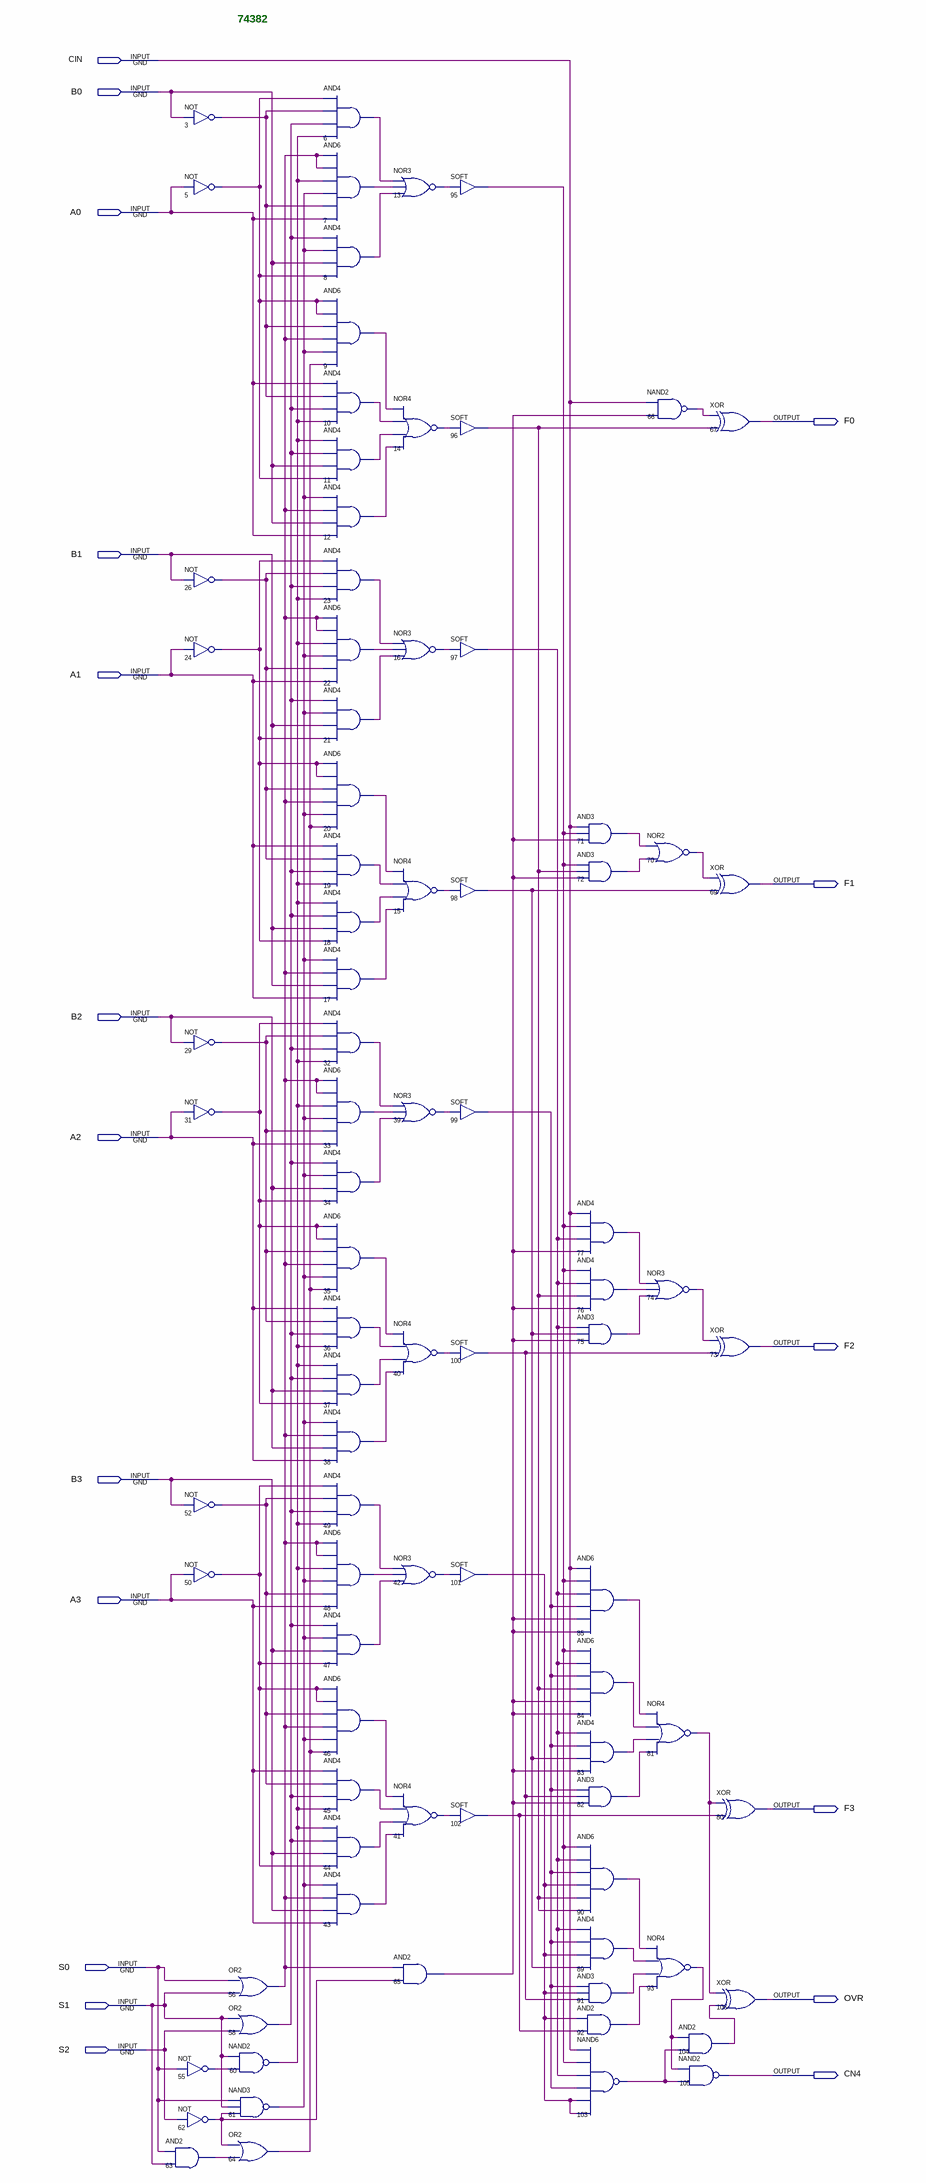
[diagram p0: schematic sheet]
// Quartus schematic 74382.bdf as structural Verilog: 87 symbols, 18 pins
module \74382  (
  input  CIN,
  input  B0,
  input  A0,
  input  B1,
  input  A1,
  input  B2,
  input  A2,
  input  B3,
  input  A3,
  input  S0,
  input  S1,
  input  S2,
  output F0,
  output F1,
  output F2,
  output F3,
  output OVR,
  output CN4
);

  wire n3_out, n5_out, n6_out, n7_out, n8_out, n9_out, n10_out, n11_out, n12_out, n13_out, n14_out, n15_out,
       n16_out, n17_out, n18_out, n19_out, n20_out, n21_out, n22_out, n23_out, n24_out, n26_out, n29_out,
       n31_out, n32_out, n33_out, n34_out, n35_out, n36_out, n37_out, n38_out, n39_out, n40_out, n41_out,
       n42_out, n43_out, n44_out, n45_out, n46_out, n47_out, n48_out, n49_out, n50_out, n52_out, n55_out,
       n56_out, n58_out, n60_out, n61_out, n62_out, n63_out, n64_out, n65_out, n66_out, n70_out, n71_out,
       n72_out, n74_out, n75_out, n76_out, n77_out, n81_out, n82_out, n83_out, n84_out, n85_out, n89_out,
       n90_out, n91_out, n92_out, n93_out, n95_out, n96_out, n97_out, n98_out, n99_out, n100_out, n101_out,
       n102_out, n103_out, n104_out;

  not u_3 (n3_out, B0);
  not u_5 (n5_out, A0);
  not u_26 (n26_out, B1);
  not u_24 (n24_out, A1);
  not u_29 (n29_out, B2);
  not u_31 (n31_out, A2);
  not u_52 (n52_out, B3);
  not u_50 (n50_out, A3);
  not u_55 (n55_out, S0);
  not u_62 (n62_out, S2);
  and u_63 (n63_out, S0, S1);
  or u_56 (n56_out, S0, S1);
  or u_58 (n58_out, S1, S2);
  nand u_60 (n60_out, S1, n55_out);
  nand u_61 (n61_out, S0, S1, n62_out);
  or u_64 (n64_out, n62_out, n63_out);
  and u_6 (n6_out, n5_out, n3_out, n58_out, n60_out);
  and u_7 (n7_out, n56_out, n56_out, n60_out, n61_out, n3_out, A0);
  and u_8 (n8_out, n58_out, n61_out, B0, n5_out);
  and u_9 (n9_out, n5_out, n5_out, n3_out, n56_out, n61_out, n64_out);
  and u_10 (n10_out, A0, n3_out, n58_out, n60_out);
  and u_11 (n11_out, n60_out, n58_out, B0, n5_out);
  and u_12 (n12_out, n61_out, n56_out, B0, A0);
  and u_23 (n23_out, n24_out, n26_out, n58_out, n60_out);
  and u_22 (n22_out, n56_out, n56_out, n60_out, n61_out, n26_out, A1);
  and u_21 (n21_out, n58_out, n61_out, B1, n24_out);
  and u_20 (n20_out, n24_out, n24_out, n26_out, n56_out, n61_out, n64_out);
  and u_19 (n19_out, A1, n26_out, n58_out, n60_out);
  and u_18 (n18_out, n60_out, n58_out, B1, n24_out);
  and u_17 (n17_out, n61_out, n56_out, B1, A1);
  and u_32 (n32_out, n31_out, n29_out, n58_out, n60_out);
  and u_33 (n33_out, n56_out, n56_out, n60_out, n61_out, n29_out, A2);
  and u_34 (n34_out, n58_out, n61_out, B2, n31_out);
  and u_35 (n35_out, n31_out, n31_out, n29_out, n56_out, n61_out, n64_out);
  and u_36 (n36_out, A2, n29_out, n58_out, n60_out);
  and u_37 (n37_out, n60_out, n58_out, B2, n31_out);
  and u_38 (n38_out, n61_out, n56_out, B2, A2);
  and u_49 (n49_out, n50_out, n52_out, n58_out, n60_out);
  and u_48 (n48_out, n56_out, n56_out, n60_out, n61_out, n52_out, A3);
  and u_47 (n47_out, n58_out, n61_out, B3, n50_out);
  and u_46 (n46_out, n50_out, n50_out, n52_out, n56_out, n61_out, n64_out);
  and u_45 (n45_out, A3, n52_out, n58_out, n60_out);
  and u_44 (n44_out, n60_out, n58_out, B3, n50_out);
  and u_43 (n43_out, n61_out, n56_out, B3, A3);
  nor u_13 (n13_out, n6_out, n7_out, n8_out);
  nor u_14 (n14_out, n9_out, n10_out, n11_out, n12_out);
  nor u_16 (n16_out, n23_out, n22_out, n21_out);
  nor u_15 (n15_out, n20_out, n19_out, n18_out, n17_out);
  nor u_39 (n39_out, n32_out, n33_out, n34_out);
  nor u_40 (n40_out, n35_out, n36_out, n37_out, n38_out);
  nor u_42 (n42_out, n49_out, n48_out, n47_out);
  nor u_41 (n41_out, n46_out, n45_out, n44_out, n43_out);
  and u_65 (n65_out, n56_out, n62_out);
  SOFT u_95 (.IN(n13_out), .OUT(n95_out));
  SOFT u_96 (.IN(n14_out), .OUT(n96_out));
  SOFT u_97 (.IN(n16_out), .OUT(n97_out));
  SOFT u_98 (.IN(n15_out), .OUT(n98_out));
  SOFT u_99 (.IN(n39_out), .OUT(n99_out));
  SOFT u_100 (.IN(n40_out), .OUT(n100_out));
  SOFT u_101 (.IN(n42_out), .OUT(n101_out));
  SOFT u_102 (.IN(n41_out), .OUT(n102_out));
  and u_71 (n71_out, CIN, n95_out, n65_out);
  and u_72 (n72_out, n95_out, n96_out, n65_out);
  and u_77 (n77_out, CIN, n95_out, n97_out, n65_out);
  and u_76 (n76_out, n95_out, n97_out, n96_out, n65_out);
  and u_75 (n75_out, n97_out, n98_out, n65_out);
  and u_85 (n85_out, CIN, n95_out, n97_out, n99_out, n65_out, n65_out);
  and u_84 (n84_out, n95_out, n97_out, n99_out, n96_out, n65_out, n65_out);
  and u_83 (n83_out, n97_out, n99_out, n98_out, n65_out);
  and u_82 (n82_out, n99_out, n100_out, n65_out);
  and u_90 (n90_out, n95_out, n97_out, n99_out, n101_out, n96_out, n96_out);
  and u_89 (n89_out, n97_out, n99_out, n101_out, n98_out);
  and u_91 (n91_out, n99_out, n101_out, n100_out);
  and u_92 (n92_out, n101_out, n102_out);
  nand u_103 (n103_out, CIN, n95_out, n97_out, n99_out, n101_out, n101_out);
  nand u_66 (n66_out, CIN, n65_out);
  nor u_70 (n70_out, n71_out, n72_out);
  nor u_74 (n74_out, n77_out, n76_out, n75_out);
  nor u_81 (n81_out, n85_out, n84_out, n83_out, n82_out);
  nor u_93 (n93_out, n90_out, n89_out, n91_out, n92_out);
  and u_104 (n104_out, n93_out, n103_out);
  nand u_105 (CN4, n93_out, n103_out);
  xor u_67 (F0, n66_out, n96_out);
  xor u_69 (F1, n70_out, n98_out);
  xor u_73 (F2, n74_out, n100_out);
  xor u_80 (F3, n81_out, n102_out);
  xor u_106 (OVR, n81_out, n104_out);

  // Notes on the sheet:
  //   74382
endmodule
